# Altium schematic sheet 1_P1.schdoc
size 309 x 223 mm; Symbol: Sheet-Symbol_A4; Device: Sheet-Symbol_A4; @Page Name: P1; @Create Date: 2024-05-07; @Page Count: 1; @Page No: 1; @Project Name: RC522; @Schematic Name: Schematic1; @Update Date: 2024-05-08; Company: 嘉立创EDA; Page Size: A4; Version: V1.0
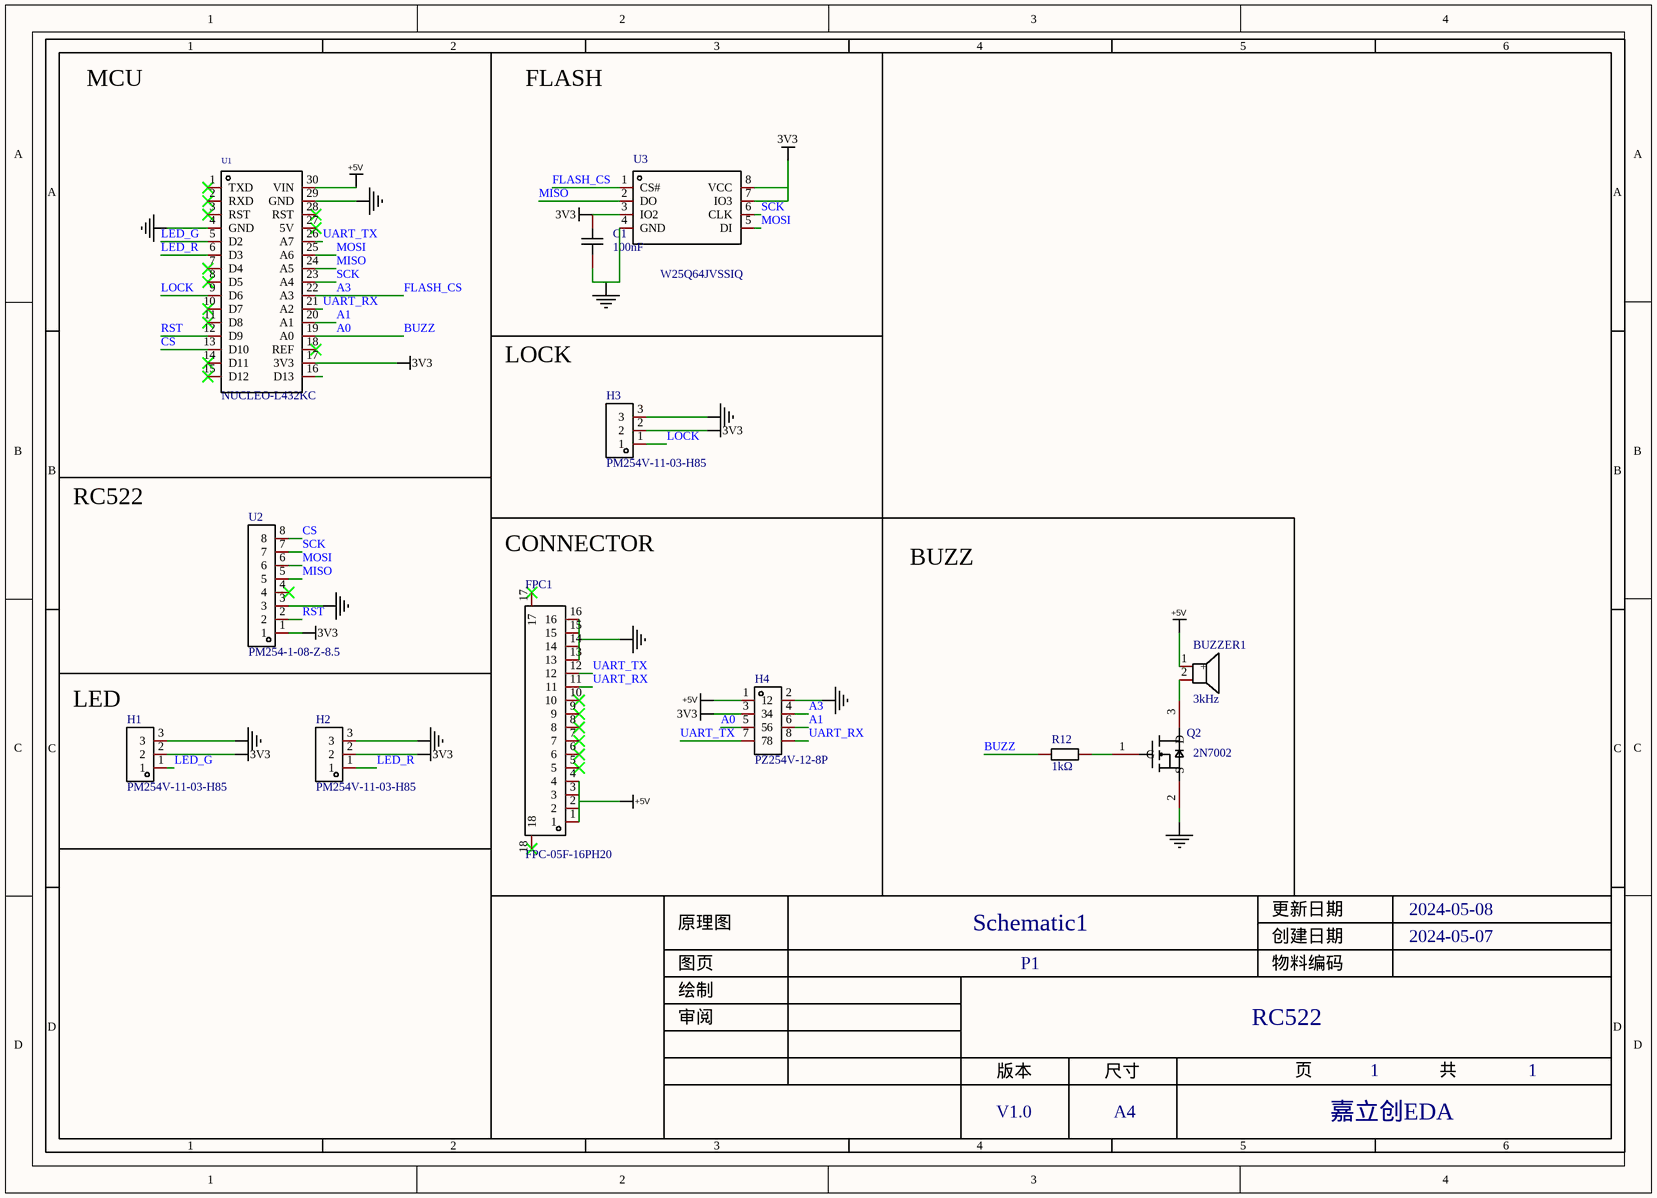
[diagram p0: 1_P1.schdoc]

## Parts
BUZZER1  3kHz  [BUZ-TH_BD9.6-P5.00-D0.7-FD]
C1  100nF  [C0603]
FPC1  FPC-05F-16PH20  [FPC-SMD_16P-P0.50_FPC-05F-16PH20]
H1  PM254V-11-03-H85  [HDR-TH_3P-P2.54-V-F]
H2  PM254V-11-03-H85  [HDR-TH_3P-P2.54-V-F]
H3  PM254V-11-03-H85  [HDR-TH_3P-P2.54-V-F]
H4  PZ254V-12-8P  [HDR-TH_8P-P2.54-V-M-R2-C4-S2.54]
Q2  2N7002  [SOT-23-3_L2.9-W1.3-P1.90-LS2.4-BR]
R12  1kΩ  [R0603]
U1  NUCLEO-L432KC  [DIP-30_L51.0-W17.8-P2.54-LS15.2-TL]
U2  PM254-1-08-Z-8.5  [HDR-TH_8P-P2.54-V-F]
U3  W25Q64JVSSIQ  [SOP-8_L5.3-W5.3-P1.27-LS8.0-BL]

## Nets
3V3: C1.2 H1.2 H2.2 H3.2 H4.3 U1.17(3V3) U2.1 U3.3(IO2) U3.7(IO3) U3.8(VCC)
+5V: BUZZER1.1(+) FPC1.1 FPC1.2 FPC1.3 FPC1.4 H4.1 U1.30(VIN)
NetC1_1: C1.1 FPC1.13 FPC1.14 FPC1.15 FPC1.16 H1.3 H2.3 H3.3 H4.2 Q2.2(S) U1.4(GND) U1.29(GND) U2.3 U3.4(GND)
A0: H4.5 R12.2 U1.19(A0)  [also labelled BUZZ]
A1: H4.6 U1.20(A1)
A3: H4.4 U1.22(A3) U3.1(CS#)  [also labelled FLASH_CS]
CS: U1.13(D10) U2.8
LED_G: H1.1 U1.5(D2)
LED_R: H2.1 U1.6(D3)
LOCK: H3.1 U1.9(D6)
MISO: U1.24(A5) U2.5 U3.2(DO)
MOSI: U1.25(A6) U2.6 U3.5(DI)
RST: U1.12(D9) U2.2
SCK: U1.23(A4) U2.7 U3.6(CLK)
UART_RX: FPC1.11 H4.8 U1.21(A2)
UART_TX: FPC1.12 H4.7 U1.26(A7)
NetBUZZER1_2: BUZZER1.2 Q2.3(D)
NetQ2_1: Q2.1(G) R12.1

Not connected (* = marked no-connect by the designer): FPC1 5* 6* 7* 8* 9* 10* 17* 18*; U1 1(TXD)* 2(RXD)* 3(RST)* 7(D4)* 8(D5)* 10(D7)* 11(D8)* 14(D11)* 15(D12)* 16(D13) 18(REF)* 27(5V)* 28(RST)*; U2 4*

## Notes on the sheet
- 1
- 2
- 3
- 4
- 5
- 6
- A
- B
- C
- 原理图
- Schematic1
- 创建日期
- 更新日期
- 2024-05-07
- 2024-05-08
- 审阅
- 绘制
- 图页
- P1
- 物料编码
- RC522
- D
- 版本
- 尺寸
- 页
- 共
- V1.0
- A4
- 嘉立创EDA
- (in symbol PZ254V-12-8P) MCU; FLASH; LOCK; RC522; CONNECTOR; BUZZ; LED

## Library data of the parts
BUZZER1 = HNB09A05: 驱动方式:有源(内含驱动线路);构造类型:电磁式;频率:3kHz;声压(SPL):85dB@5V,10cm;; Manufacturer: 华能; Add into BOM: yes; Technology Type: 电磁式; Operating Voltage: 4V~8V; Name: 3kHz; Symbol: HNB09A05; Device: HNB09A05; LCSC Part Name: HNB09A05; Supplier Part: C96493; Manufacturer Part: HNB09A05; Supplier Footprint: 插件,D=9mm; JLCPCB Part Class: 扩展库; Datasheet: https://atta.szlcsc.com/upload/public/pdf/source/20170522/1495448327549.pdf; Supplier: LCSC; Convert to PCB: yes; Oscillator Circuit: 有源(内含驱动线路); Value: 3kHz; Sound Pressure Level (SPL): 85dB@5V,10cm; Diameter (φD): 9mm; Height: 5.7mm
C1 = CC0603KRX7R9BB104: 容值:100nF;精度:±10%;额定电压:50V;材质(温度系数):X7R;; Manufacturer: YAGEO(国巨); Add into BOM: yes; Tolerance: ±10%; Voltage Rated: 50V; Temperature Coefficient: X7R; Name: 100nF; Symbol: CC0603KRX7R9BB104; Device: CC0603KRX7R9BB104; LCSC Part Name: 100nF ±10% 50V; Supplier Part: C14663; Manufacturer Part: CC0603KRX7R9BB104; Supplier Footprint: 0603; JLCPCB Part Class: 基础库; Datasheet: https://atta.szlcsc.com/upload/public/pdf/source/20180910/C282072_33301C7F631E79921B82A8DAC6BCC5B3.pdf; Supplier: LCSC; Convert to PCB: yes; Value: 100nF
FPC1 = FPC-05F-16PH20: 锁定特性:翻盖式;触点类型:下接;触点数量:16P;间距:0.5mm;安装类型:卧贴;工作温度范围:-25℃~+85℃;; Manufacturer: XUNPU(讯普); Add into BOM: yes; Locking Feature: 翻盖式; Number of Contacts: 16P; Pitch: 0.5mm; FFC, FCB Thickness: 0.3mm; Name: FPC-05F-16PH20; Symbol: FPC-05F-16PH20; Device: FPC-05F-16PH20; LCSC Part Name: 间距:0.5mm P数:16P 翻盖式 下接; Supplier Part: C2856801; Manufacturer Part: FPC-05F-16PH20; Supplier Footprint: SMD,P=0.5mm,卧贴; JLCPCB Part Class: 扩展库; Datasheet: https://atta.szlcsc.com/upload/public/pdf/source/20210922/C2856801_73A554E58C5577257FCEC843978D3BA6.pdf; Supplier: LCSC; Convert to PCB: yes; Contact Type: 下接; Mounting Type: 卧贴; Height Above Board: 2mm; Operating Temperature Range: -25℃~+85℃
H1-H3 = PM254V-11-03-H85: 插孔结构:1x3P;间距:2.54mm;行距:-;安装类型:直插;排数:单排;总孔位数:3P;塑高:-;触头材质:黄铜;触头镀层:-;; Manufacturer: XFCN(兴飞); Add into BOM: yes; Holes Structure: 1x3P; Pitch: 2.54mm; Number of Holes: 3P; Name: PM254V-11-03-H85; Symbol: PM254V-11-03-H85; Device: PM254V-11-03-H85; LCSC Part Name: 间距:2.54mm 1x3P 直插; Supplier Part: C541850; Manufacturer Part: PM254V-11-03-H85; Supplier Footprint: 插件,P=2.54mm; JLCPCB Part Class: 扩展库; Datasheet: https://atta.szlcsc.com/upload/public/pdf/source/20200518/C541849_85853D71FC67C51915A806977A588FDA.pdf; Supplier: LCSC; Convert to PCB: yes; Row Spacing: -; Mounting Type: 直插; Number of Rows: 单排; Insulation Height: -; Contact Material: 黄铜; Contact Plating: -
H4 = PZ254V-12-8P: 插针结构:2x4P;间距:2.54mm;行距:2.54mm;圆针/方针:方针;安装类型:直插;排数:双排;总PIN位数:8P;额定电流:-;额定电压:-;配合针长度:6mm;塑高:2.5mm;端接针长度:3mm;触头材质:黄铜;触头镀层:-;工作温度范围:-40℃~+105℃;颜色:黑色;; Manufacturer: XFCN(兴飞); Add into BOM: yes; Pin Structure: 2x4P; Pitch: 2.54mm; Circluar Pins/Square Pins: 方针; Name: PZ254V-12-8P; Symbol: PZ254V-12-8P; Device: PZ254V-12-8P; LCSC Part Name: 间距:2.54mm 2x4P 直插 方针; Supplier Part: C492421; Manufacturer Part: PZ254V-12-8P; Supplier Footprint: 插件,P=2.54mm; JLCPCB Part Class: Extended Part; Datasheet: https://atta.szlcsc.com/upload/public/pdf/source/20200309/C492421_DC8A206AF99CD7755BD4A5B0BC48200B.pdf; Supplier: LCSC; Convert to PCB: yes; Row Spacing: 2.54mm; Mounting Type: 直插; Number of Rows: 双排; Number of Pins: 8P; Current Rating (Max): -; Voltage Rating (Max): -; Length of Mating Pin: 6mm; Insulation Height: 2.5mm; Length of End Connection Pin: 3mm; Contact Material: 黄铜; Contact Plating: -; Operating Temperature Range: -40℃~+105℃; Color: 黑色
Q2 = 2N7002_C916396: 类型:N沟道;漏源电压(Vdss):60V;连续漏极电流(Id):115mA;功率(Pd):200mW;导通电阻(RDS(on)@Vgs,Id):1.2Ω@10V,500mA;阈值电压(Vgs(th)@Id):2.1V@250uA;; Manufacturer: JSMSEMI(杰盛微); Add into BOM: yes; Type: N沟道; Drain Source Voltage (Vdss): 60V; Continuous Drain Current (Id): 115mA; Power Dissipation (Pd): 200mW; Input Capacitance (Ciss@Vds): 20pF@25V; Reverse Transfer Capacitance (Crss@Vds): 4pF@25V; Name: 2N7002; Symbol: 2N7002_C916396; Device: 2N7002_C916396; LCSC Part Name: N沟道 耐压:60V 电流:115mA; Supplier Part: C916396; Manufacturer Part: 2N7002; Supplier Footprint: SOT-23; JLCPCB Part Class: 扩展库; Datasheet: https://atta.szlcsc.com/upload/public/pdf/source/20230714/89F30C6A193AD72E5F1F14B53E304F4A.pdf; Supplier: LCSC; Convert to PCB: yes; Drain Source On Resistance (RDS(on)@Vgs,Id): 1.2Ω@10V,500mA; Gate Threshold Voltage (Vgs(th)@Id): 2.1V@250uA; Total Gate Charge (Qg@Vgs): -; Operating Temperature: -
R12 = RC0603FR-071KL: 电阻类型:厚膜电阻;阻值:1kΩ;精度:±1%;功率:100mW;最大工作电压:75V;温度系数:±100ppm/℃;; Manufacturer: YAGEO(国巨); Add into BOM: yes; Tolerance: ±1%; Power(Watts): 100mW; Overload Voltage (Max): 75V; Name: 1kΩ; Symbol: RC0603FR-071KL; Device: RC0603FR-071KL; LCSC Part Name: 厚膜电阻 1kΩ ±1% 100mW; Supplier Part: C22548; Manufacturer Part: RC0603FR-071KL; Supplier Footprint: 0603; JLCPCB Part Class: 扩展库; Datasheet: https://atta.szlcsc.com/upload/public/pdf/source/20180316/70C0E2BDAE7FCC62C531A5A58D202EE1.pdf; Supplier: LCSC; Convert to PCB: yes; Type: 厚膜电阻; Value: 1kΩ; Temperature Coefficient: ±100ppm/℃; Operating Temperature Range: -55℃~+155℃
U1 = NUCLEO-L432KC: 处理器:-;运行内存:-;USB:-;WIFI协议:-;蓝牙:-;以太网:-;; Manufacturer: ST(意法半导体); Add into BOM: yes; Name: NUCLEO-L432KC; Symbol: NUCLEO-L432KC; Device: NUCLEO-L432KC; LCSC Part Name: NUCLEO-L432KC; Supplier Part: C94814; Manufacturer Part: NUCLEO-L432KC; Supplier Footprint: -; JLCPCB Part Class: Extended Part; Datasheet: https://atta.szlcsc.com/upload/public/pdf/source/20170211/1486785668619.pdf; Supplier: LCSC; Convert to PCB: yes; CPU: -; ROM Size: -; Number of I/O: -; USB: -; WIFI Protocols: -; Bluetooth: -; Ethernet: -; Audio & Video Interface: -; Multimedia Support: -; Card Type: -; Power Supply Type: -; Power Supply: -; POE Support: -; Resolution: -; Temperature Range: -
U2 = PM254-1-08-Z-8.5: 插孔结构:1x8P;间距:2.54mm;行距:-;圆孔/方孔:方孔;安装类型:直插;排数:单排;总孔位数:8P;额定电流:3A;额定电压:-;插孔方向:顶部;塑高:8.5mm;触头材质:铜合金;工作温度范围:-40℃~+105℃;焊接温度(最大值):260℃@5S;; Manufacturer: HCTL(华灿天禄); Add into BOM: yes; Holes Structure: 1x8P; Pitch: 2.54mm; Circular Hole / Square Hole: 方孔; Number of Holes: 8P; Current Rating (Max): 3A; Holes Direction: 顶部; Name: PM254-1-08-Z-8.5; Symbol: PM254-1-08-Z-8.5; Device: PM254-1-08-Z-8.5; LCSC Part Name: 1x8P 间距:2.54mm 直插; Supplier Part: C2897371; Manufacturer Part: PM254-1-08-Z-8.5; Supplier Footprint: 插件,P=2.54mm; JLCPCB Part Class: 扩展库; Datasheet: https://atta.szlcsc.com/upload/public/pdf/source/20230609/534BE42964C679BDE98E061007C4ABD6.pdf; Supplier: LCSC; Convert to PCB: yes; Row Spacing: -; Mounting Type: 直插; Number of Rows: 单排; Voltage Rating (Max): -; Insulation Height: 8.5mm; Contact Material: 铜合金; Operating Temperature Range: -40℃~+105℃; Soldering Temperature(Max): 260℃@5S
U3 = W25Q64JVSSIQ_C83140: 64M-bit/8M-byte FLASH芯片,SPI接口 133MHz(266/532MHz Dual/Quad-SPI) 比W25Q64FVSSIG更高速度; Manufacturer: WINBOND(华邦); Add into BOM: yes; Name: W25Q64JVSSIQ; Symbol: W25Q64JVSSIQ; Device: W25Q64JVSSIQ_C83140; LCSC Part Name: W25Q64JVSSIQ; Supplier Part: C83140; Manufacturer Part: W25Q64JVSSIQ; Supplier Footprint: SOP-8-208mil; JLCPCB Part Class: 扩展库; Datasheet: https://atta.szlcsc.com/upload/public/pdf/source/20161110/1478742546019.pdf; Supplier: LCSC; Convert to PCB: yes